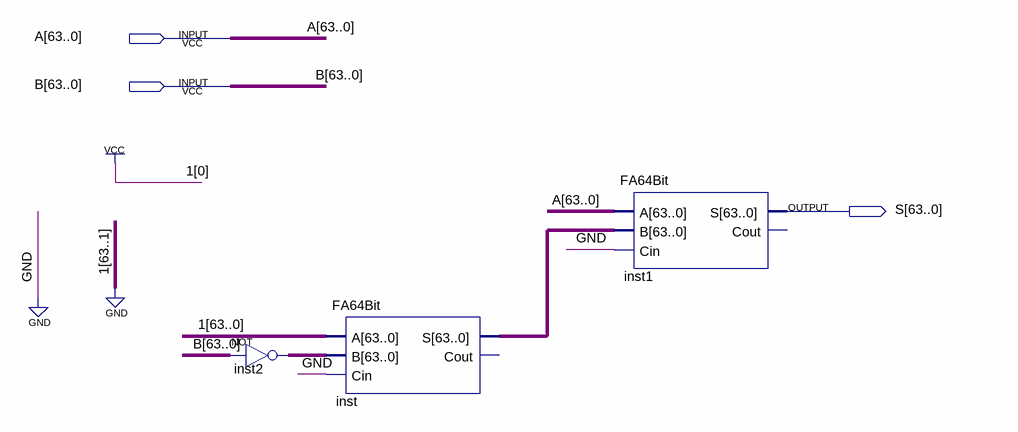
[diagram p0: schematic sheet]
// Quartus schematic SUB64Bit.bdf as structural Verilog: 3 symbols, 3 pins
module SUB64Bit (
  input  [63:0] A,
  input  [63:0] B,
  output [63:0] S
);

  wire [63:0] inst2_out, inst_s;

  assign inst2_out = ~B;  // NOT inst2, 64 bits wide
  FA64Bit inst (
    .A(64'b0000000000000000000000000000000000000000000000000000000000000001), .B(inst2_out), .Cin(1'b0),
    .S(inst_s));  // open: Cout
  FA64Bit inst1 (.A(A), .B(inst_s), .Cin(1'b0), .S(S));  // open: Cout
endmodule
